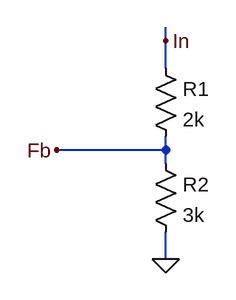
[diagram p0: schematic feedback_network.asc]
feedback_network.asc, the LTspice schematic file:
Version 4
SHEET 1 880 680
WIRE 176 64 176 48
WIRE 176 96 176 64
WIRE 176 192 176 176
WIRE 176 192 48 192
WIRE 176 208 176 192
WIRE 176 320 176 288
FLAG 176 64 In
FLAG 48 192 Fb
FLAG 176 320 0
SYMBOL res 160 80 R0
SYMATTR InstName R1
SYMATTR Value 2k
SYMBOL res 160 192 R0
SYMATTR InstName R2
SYMATTR Value 3k

The netlist it stands for:
* feedback_network.asc
R1 In Fb 2k
R2 Fb 0 3k
.backanno
.end